# EAGLE board 16 seg display board (EAGLE 9.6.1), part 1 of 2
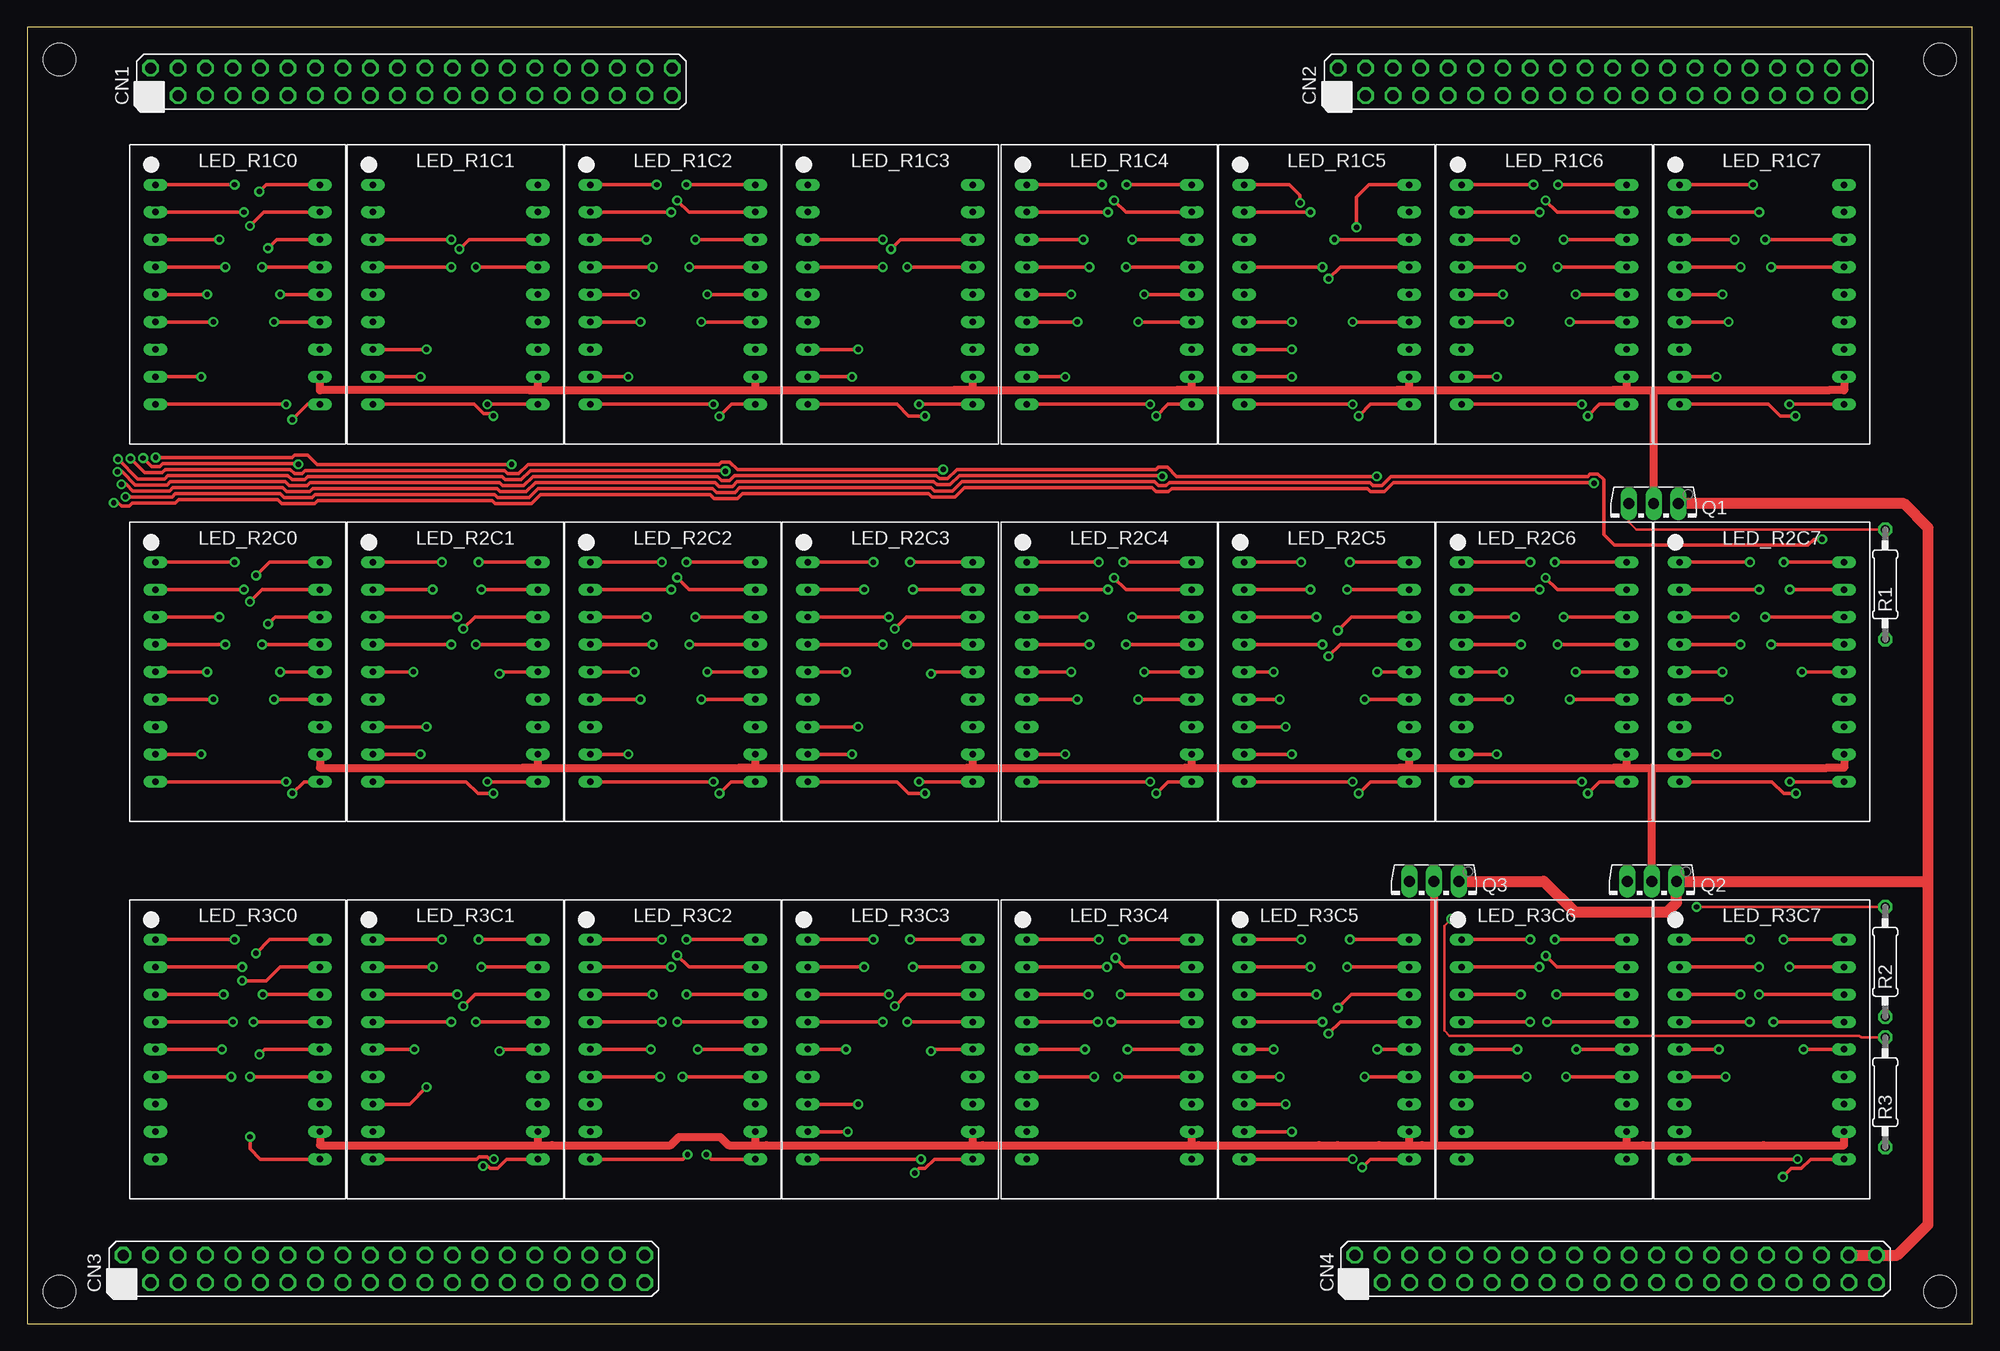
[diagram p2: board, top side]
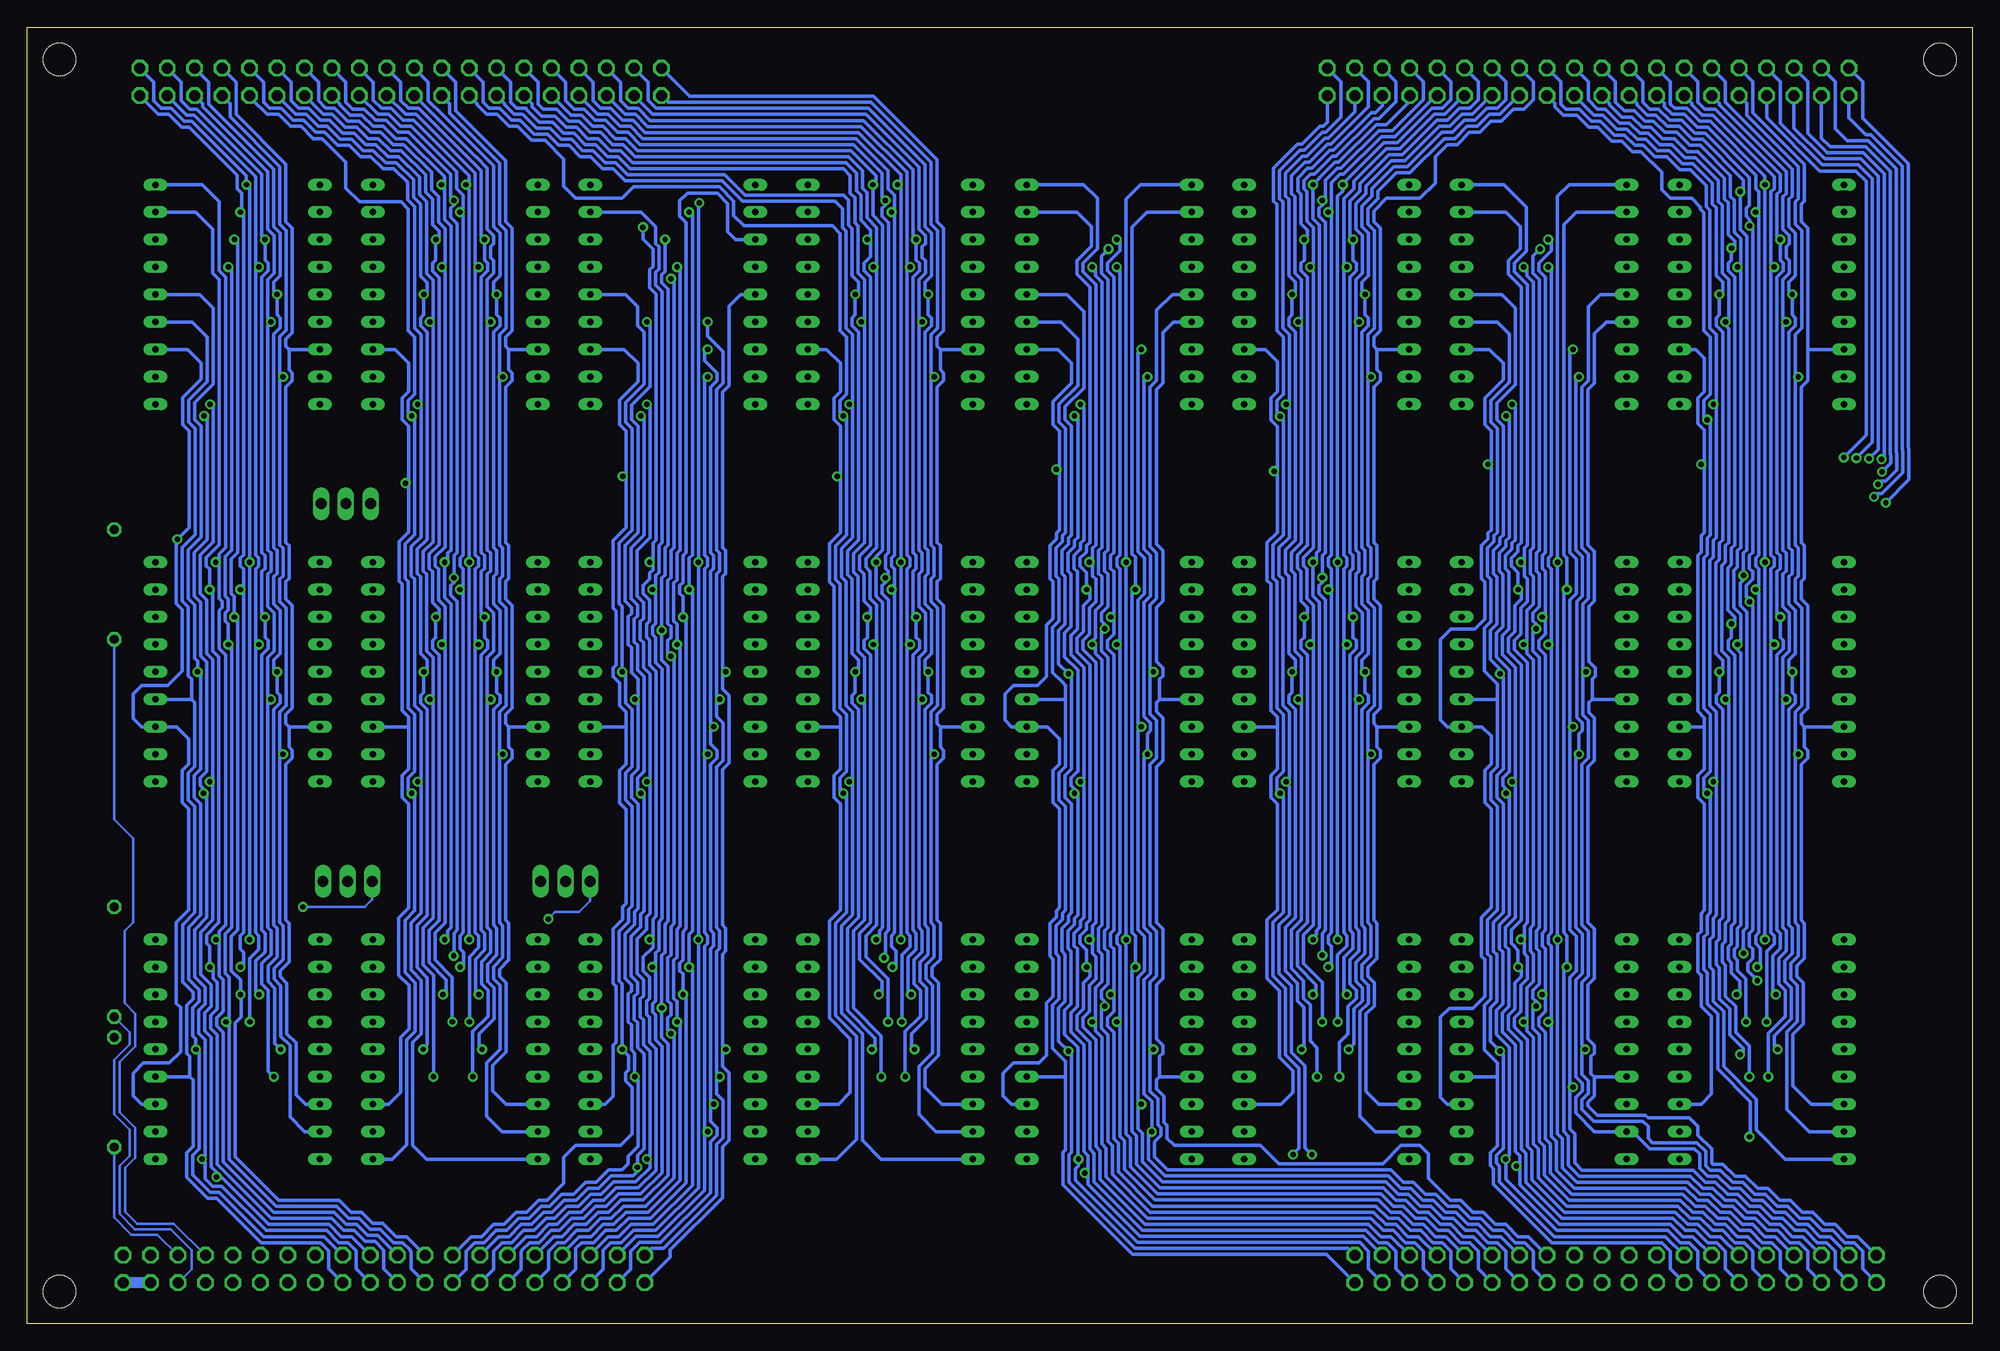
[diagram p3: board, bottom side, seen from below]

Size 180 x 120 mm. Coordinates in mm from the lower left corner, seen from the top.
Outline: 0,0 180,0 180,120 0,120 0,0
Copper layers (1*16): Top 0.035mm / dielectric 1.5mm / Bottom 0.035mm
Design rules "default *": minimum track width 10mil, minimum drill 0.35mm, track to track 10mil, track to pad 10mil, pad to pad 10mil, via to via 10mil, smd to smd 10mil, copper to edge 40mil, drill to drill 6mil, minimum pad ring 10mil, minimum via ring 8mil, stop-mask expansion 4mil, vias tented up to drill 20mil, thermal gap 10mil
Holes 3 mm at 3,117 177,117 177,3 3,3

## Footprints (pad centres in the part's own frame; a part is rotated, then mirrored left to right if it is on the bottom)
HDR40 = drill 1.016 octagon: 1 -24.13,-1.27; 2 -24.13,1.27; 3 -21.59,-1.27; 4 -21.59,1.27; 5 -19.05,-1.27; 6 -19.05,1.27; 7 -16.51,-1.27; 8 -16.51,1.27; 9 -13.97,-1.27; 10 -13.97,1.27; 11 -11.43,-1.27; 12 -11.43,1.27; 13 -8.89,-1.27; 14 -8.89,1.27; 15 -6.35,-1.27; 16 -6.35,1.27; 17 -3.81,-1.27; 18 -3.81,1.27; 19 -1.27,-1.27; 20 -1.27,1.27; 21 1.27,-1.27; 22 1.27,1.27; 23 3.81,-1.27; 24 3.81,1.27; 25 6.35,-1.27; 26 6.35,1.27; 27 8.89,-1.27; 28 8.89,1.27; 29 11.43,-1.27; 30 11.43,1.27; 31 13.97,-1.27; 32 13.97,1.27; 33 16.51,-1.27; 34 16.51,1.27; 35 19.05,-1.27; 36 19.05,1.27; 37 21.59,-1.27; 38 21.59,1.27; 39 24.13,-1.27; 40 24.13,1.27
PSA08-11SYKWA = drill 0.6 long: 1 -7.62,10.16; 2 -7.62,7.62; 3 -7.62,5.08; 4 -7.62,2.54; 5 -7.62,0; 6 -7.62,-2.54; 7 -7.62,-5.08; 8 -7.62,-7.62; 9 -7.62,-10.16; 10 7.62,-10.16; 11 7.62,-7.62; 12 7.62,-5.08; 13 7.62,-2.54; 14 7.62,0; 15 7.62,2.54; 16 7.62,5.08; 17 7.62,7.62; 18 7.62,10.16
TO126AV = drill 1.016 long: B 2.286,-1.27; C 0,-1.27; E -2.286,-1.27
0207/10 = drill 0.813 octagon: 1 -5.08,0; 2 5.08,0

## Placement (x,y rotation side)
CN1  [HDR40]  35.56,114.92 0 top
CN2  [HDR40]  145.44,114.92 0 top
CN3  [HDR40]  33.02,5.08 0 top
CN4  [HDR40]  146.98,5.08 0 top
LED_R1C0  PSA08-11SYKWA  [PSA08-11SYKWA]  19.5,95.25 0 top
LED_R1C1  PSA08-11SYKWA  [PSA08-11SYKWA]  39.62,95.25 0 top
LED_R1C2  PSA08-11SYKWA  [PSA08-11SYKWA]  59.75,95.25 0 top
LED_R1C3  PSA08-11SYKWA  [PSA08-11SYKWA]  79.88,95.25 0 top
LED_R1C4  PSA08-11SYKWA  [PSA08-11SYKWA]  100.12,95.25 0 top
LED_R1C5  PSA08-11SYKWA  [PSA08-11SYKWA]  120.25,95.25 0 top
LED_R1C6  PSA08-11SYKWA  [PSA08-11SYKWA]  140.38,95.25 0 top
LED_R1C7  PSA08-11SYKWA  [PSA08-11SYKWA]  160.5,95.25 0 top
LED_R2C0  PSA08-11SYKWA  [PSA08-11SYKWA]  19.5,60.33 0 top
LED_R2C1  PSA08-11SYKWA  [PSA08-11SYKWA]  39.62,60.33 0 top
LED_R2C2  PSA08-11SYKWA  [PSA08-11SYKWA]  59.75,60.33 0 top
LED_R2C3  PSA08-11SYKWA  [PSA08-11SYKWA]  79.88,60.33 0 top
LED_R2C4  PSA08-11SYKWA  [PSA08-11SYKWA]  100.12,60.33 0 top
LED_R2C5  PSA08-11SYKWA  [PSA08-11SYKWA]  120.25,60.33 0 top
LED_R2C6  PSA08-11SYKWA  [PSA08-11SYKWA]  140.38,60.33 0 top
LED_R2C7  PSA08-11SYKWA  [PSA08-11SYKWA]  160.5,60.33 0 top
LED_R3C0  PSA08-11SYKWA  [PSA08-11SYKWA]  19.5,25.4 0 top
LED_R3C1  PSA08-11SYKWA  [PSA08-11SYKWA]  39.62,25.4 0 top
LED_R3C2  PSA08-11SYKWA  [PSA08-11SYKWA]  59.75,25.4 0 top
LED_R3C3  PSA08-11SYKWA  [PSA08-11SYKWA]  79.88,25.4 0 top
LED_R3C4  PSA08-11SYKWA  [PSA08-11SYKWA]  100.12,25.4 0 top
LED_R3C5  PSA08-11SYKWA  [PSA08-11SYKWA]  120.25,25.4 0 top
LED_R3C6  PSA08-11SYKWA  [PSA08-11SYKWA]  140.38,25.4 0 top
LED_R3C7  PSA08-11SYKWA  [PSA08-11SYKWA]  160.5,25.4 0 top
Q1  BD438  [TO126AV]  150.5,74.61 180 top
Q2  BD438  [TO126AV]  150.34,39.69 180 top
Q3  BD438  [TO126AV]  130.18,39.69 180 top
R1  1K  [0207/10]  171.93,68.42 90 top
R2  1K  [0207/10]  171.93,33.5 90 top
R3  1K  [0207/10]  171.93,21.43 90 top

## Tracks (layer width: path | path; a pad name or v marks a point on that pad's centre or on a via)
+5V
  Top 1.016: CN4.38 CN4.40 173.04,6.35 175.9,9.21 175.9,40.96 | 175.9,40.96 175.9,73.66 173.67,75.88 Q1.E | 175.9,40.96 Q2.E 152.62,38.96 151.76,38.1 143.19,38.1 140.34,40.96 Q3.E
COL0_A  (via drill 0.5)
  Top 0.305: v19.21,105.41 LED_R1C0.1 | v19.21,70.48 LED_R2C0.1 | v19.21,35.56 LED_R3C0.1
  Bottom 0.305: CN1.16 27.94,114.92 27.94,112.87 27.55,112.48 26.43,112.48 25.23,111.28 24.27,111.28 19.21,106.22 v19.21,105.41 v19.21,70.48 v19.21,35.56
COL0_B  (via drill 0.5)
  Top 0.305: v21.49,104.78 22.12,105.41 LED_R1C0.18 | v21.2,69.25 22.43,70.48 LED_R2C0.18 | v21.19,34.29 22.46,35.56 LED_R3C0.18
  Bottom 0.305: CN1.17 31.04,112.94 31.04,112.8 30.08,111.84 29.28,111.84 28.25,110.81 27.13,110.81 25.92,109.6 24.96,109.6 21.19,105.82 21.19,105.08 v21.49,104.78 21.49,101.24 20.98,100.74 20.89,100.65 20.89,71.61 21.19,71.3 21.19,69.26 v21.2,69.25 21.2,68.82 21.49,68.53 21.49,66.48 20.89,65.88 20.89,36.68 21.19,36.38 v21.19,34.29
COL0_C  (via drill 0.5)
  Top 0.305: v22.3,99.54 23.1,100.33 LED_R1C0.16 | v22.3,64.77 22.94,65.41 LED_R2C0.16 | v21.82,30.48 LED_R3C0.16
  Bottom 0.305: CN1.19 33.58,112.94 33.58,112.8 32.46,111.68 31.5,111.68 30.54,110.72 29.74,110.72 28.71,109.69 27.59,109.69 26.39,108.48 25.43,108.48 22.94,106 22.94,104.07 22.6,103.73 22.6,100.78 22,100.18 22,99.84 v22.3,99.54 22.3,98.45 22.6,98.15 22.6,97.43 22,96.83 22,72.07 22.3,71.77 22.3,70.24 22.62,69.92 22.62,66.03 22,65.41 22,65.07 v22.3,64.77 22.3,63.52 22.6,63.22 22.6,62.45 22,61.85 22,37.14 22.3,36.84 22.3,35.18 22.6,34.88 22.6,33.7 22.3,33.4 22.3,32.47 21.51,31.68 21.51,30.78 v21.82,30.48
COL0_D  (via drill 0.5)
  Top 0.305: v22.86,92.71 LED_R1C0.13 | v22.86,57.78 LED_R2C0.13 | v20.64,22.86 LED_R3C0.13
  Bottom 0.305: CN1.22 35.56,114.92 35.56,113.27 34.69,112.39 33.97,112.39 32.69,111.12 31.73,111.12 30.77,110.16 29.97,110.16 28.94,109.13 27.82,109.13 26.62,107.92 25.66,107.92 23.5,105.77 23.5,103.84 23.16,103.5 23.16,97.2 22.56,96.6 22.56,93.01 v22.86,92.71 22.86,92.39 22.56,92.09 22.56,72.3 22.86,72 22.86,70.48 23.18,70.15 23.18,62.24 22.56,61.62 22.56,58.09 v22.86,57.78 22.56,57.48 22.56,37.37 22.86,37.07 22.86,35.41 23.16,35.11 23.16,33.47 22.86,33.17 22.86,30.31 21.91,29.36 21.91,26.99 20.64,25.72 v20.64,22.86
COL0_E  (via drill 0.5)
  Top 0.305: v20.64,17.3 20.64,16.19 21.59,15.24 LED_R3C0.10 | v24.54,83.66 25.97,85.09 LED_R1C0.10 | v24.54,49.08 25.62,50.16 LED_R2C0.10
  Bottom 0.305: CN1.23 38.66,112.94 38.66,112.64 37.85,111.84 36.6,111.84 35.48,110.72 34.66,110.72 33.38,109.44 32.42,109.44 31.46,108.48 30.66,108.48 28.73,106.55 28.73,104.93 27.94,104.14 25.97,104.14 25.18,103.35 25.18,103.14 24.84,102.8 24.84,91.89 24.24,91.29 24.24,86.05 24.84,85.45 24.84,83.96 v24.54,83.66 24.24,83.36 24.24,72.99 24.54,72.69 24.54,71.17 24.86,70.85 24.86,56.99 24.24,56.36 24.24,51.12 24.84,50.52 24.84,49.38 v24.54,49.08 24.24,48.78 24.24,38.07 24.54,37.77 24.54,36.1 24.84,35.8 24.84,32.78 24.54,32.48 24.54,29.62 23.58,28.66 23.58,23.59 20.56,20.57 20.56,17.38 v20.64,17.3
COL0_F  (via drill 0.5)
  Top 0.305: v23.98,85.09 LED_R1C0.9 | v23.98,50.16 LED_R2C0.9
  Bottom 0.305: CN1.24 38.1,114.92 38.1,112.87 37.62,112.39 36.37,112.39 35.25,111.28 34.43,111.28 33.15,110 32.19,110 31.23,109.04 30.43,109.04 29.4,108.01 28.28,108.01 27.08,106.81 26.12,106.81 24.62,105.31 24.62,103.37 24.28,103.03 24.28,92.12 23.68,91.52 23.68,85.39 v23.98,85.09 23.68,84.79 23.68,72.76 23.98,72.46 23.98,70.94 24.3,70.62 24.3,57.22 23.68,56.6 23.68,50.47 v23.98,50.16 23.68,49.86 23.68,37.84 23.98,37.54 23.98,35.87 24.28,35.57 24.28,33.01 23.98,32.71 23.98,29.85 23.02,28.89 23.02,23.82 20,20.8 20,17.94 17.3,15.24 LED_R3C0.9
COL0_G  (via drill 0.5)
  Top 0.305: v16.11,87.63 LED_R1C0.8 | v16.11,52.7 LED_R2C0.8
  Bottom 0.305: CN1.9 20.88,112.94 20.88,111.85 16.11,107.08 16.11,104.13 16.41,103.83 16.41,101.75 15.81,101.15 15.81,92.12 16.41,91.52 16.41,87.93 v16.11,87.63 16.41,87.33 16.41,86.68 16.41,72.07 16.11,71.77 16.11,69.2 16.41,68.9 16.41,66.83 15.81,66.22 15.81,57.63 15.81,57.2 16.41,56.6 16.41,53.01 v16.11,52.7 16.41,52.4 16.41,37.14 16.11,36.84 16.11,34.06 16.82,33.36 16.82,31.9 16.21,31.3 16.21,27.98 17.18,27.02 17.18,25.76 17.17,25.76 17.17,19.87 15.08,17.78 LED_R3C0.8
COL0_H  (via drill 0.5)
  Top 0.305: v18.35,97.79 LED_R1C0.4 | v18.35,62.87 LED_R2C0.4 | v19.05,27.94 LED_R3C0.4
  Bottom 0.305: CN1.13 25.96,112.94 25.96,112.8 25,111.84 24.04,111.84 18.35,106.15 18.35,105.05 18.65,104.75 18.65,98.09 v18.35,97.79 18.65,97.49 18.65,71.14 18.35,70.84 18.35,70.13 18.65,69.83 18.65,63.17 v18.35,62.87 18.65,62.56 18.65,36.22 18.35,35.92 18.35,35.15 19.05,34.45 v19.05,27.94
COL0_K  (via drill 0.5)
  Top 0.305: v17.79,100.33 LED_R1C0.3 | v17.79,65.41 LED_R2C0.3 | v18.19,30.48 LED_R3C0.3
  Bottom 0.305: CN1.14 25.4,114.92 25.4,113.03 24.77,112.39 23.81,112.39 17.79,106.38 17.79,104.82 18.09,104.52 18.09,100.63 v17.79,100.33 17.79,98.45 17.49,98.15 17.49,97.43 18.09,96.83 18.09,71.37 17.79,71.07 17.79,69.9 18.09,69.6 18.09,65.71 v17.79,65.41 17.79,63.52 17.49,63.22 17.49,62.51 18.09,61.91 18.09,36.45 17.79,36.15 17.79,34.76 18.49,34.05 18.49,30.78 v18.19,30.48
COL0_M  (via drill 0.5)
  Top 0.305: v20.07,102.87 LED_R1C0.2 | v20.07,67.94 LED_R2C0.2 | v19.91,33.02 LED_R3C0.2
  Bottom 0.305: CN1.15 28.5,112.94 28.5,112.64 27.78,111.92 26.66,111.92 25.46,110.72 24.5,110.72 20.07,106.29 20.07,105.05 19.77,104.75 19.77,103.17 v20.07,102.87 19.77,102.57 19.77,71.14 20.07,70.84 20.07,70.13 19.77,69.83 19.77,68.25 v20.07,67.94 19.77,67.64 19.77,36.22 20.07,35.92 20.07,35.2 19.61,34.74 19.61,33.32 v19.91,33.02
COL0_N  (via drill 0.5)
  Top 0.305: v20.63,101.6 21.9,102.87 LED_R1C0.17 | v20.63,66.83 21.74,67.94 LED_R2C0.17 | v19.91,31.75 22.13,31.75 23.4,33.02 LED_R3C0.17
  Bottom 0.305: CN1.18 30.48,114.92 30.48,113.03 29.84,112.39 29.04,112.39 28.01,111.36 26.89,111.36 25.69,110.16 24.73,110.16 20.63,106.06 20.63,103.53 20.93,103.23 20.93,102.49 20.58,102.15 20.58,101.6 v20.63,101.6 20.33,101.3 20.33,71.37 20.63,71.07 20.63,69.9 20.33,69.6 20.33,68.9 20.93,68.3 20.93,67.27 20.65,66.99 20.64,66.99 20.64,66.85 v20.63,66.83 20.33,66.53 20.33,36.45 20.63,36.15 20.63,34.97 20.33,34.67 20.33,33.82 20.77,33.38 20.77,32.66 20.27,32.16 20.25,32.16 19.84,31.75 v19.91,31.75
COL0_P  (via drill 0.5)
  Top 0.305: v21.75,97.79 LED_R1C0.15 | v21.75,62.87 LED_R2C0.15 | v20.95,27.94 LED_R3C0.15
  Bottom 0.305: CN1.20 33.02,114.92 33.02,113.03 32.23,112.24 31.27,112.24 30.31,111.28 29.51,111.28 28.48,110.25 27.36,110.25 26.15,109.04 25.19,109.04 22.38,106.23 22.38,104.3 22.05,103.96 22.05,101.01 21.44,100.41 21.44,98.09 v21.75,97.79 21.44,97.49 21.44,71.84 21.75,71.53 21.75,70.01 22.07,69.69 22.07,66.27 21.44,65.64 21.44,63.17 v21.75,62.87 21.75,62.38 21.44,62.08 21.44,36.91 21.75,36.61 21.75,34.95 22.05,34.65 22.05,33.93 21.75,33.63 21.75,32.7 20.95,31.91 v20.95,27.94
COL0_R  (via drill 0.5)
  Top 0.305: v23.42,95.25 LED_R1C0.14 | v23.42,60.33 LED_R2C0.14 | v21.5,24.92 21.97,25.4 LED_R3C0.14
  Bottom 0.305: CN1.21 35.02,111.84 34.2,111.84 32.92,110.56 31.96,110.56 31,109.6 30.2,109.6 29.17,108.57 28.05,108.57 26.85,107.37 25.89,107.37 24.06,105.54 24.06,103.6 23.72,103.27 23.72,96.97 23.12,96.37 23.12,95.55 v23.42,95.25 23.42,93.37 23.72,93.07 23.72,92.35 23.12,91.75 23.12,72.53 23.42,72.23 23.42,70.71 23.74,70.39 23.74,62.01 23.12,61.39 23.12,60.63 v23.42,60.33 23.42,58.44 23.72,58.14 23.72,57.43 23.12,56.83 23.12,37.61 23.42,37.3 23.42,35.64 23.72,35.34 23.72,33.24 23.42,32.94 23.42,30.08 22.47,29.13 22.47,26.76 21.2,25.49 21.2,25.23 v21.5,24.92
COL0_S  (via drill 0.5)
  Top 0.305: v17.23,92.71 LED_R1C0.6 | v17.23,57.78 LED_R2C0.6 | v18.89,22.86 LED_R3C0.6
  Bottom 0.305: CN1.11 23.42,112.94 23.42,112.8 17.23,106.61 17.23,104.59 17.53,104.29 17.53,101.29 16.93,100.69 16.93,99.97 17.23,99.67 17.23,98.68 16.93,98.38 16.93,97.2 17.53,96.6 17.53,93.01 v17.23,92.71 17.53,92.41 17.53,71.61 17.23,71.3 17.23,69.67 17.53,69.36 17.53,66.36 16.93,65.76 16.93,62.28 17.53,61.68 17.53,58.09 v17.23,57.78 17.53,57.48 17.53,36.68 17.23,36.38 17.23,34.52 17.93,33.82 17.93,31.44 17.33,30.84 17.33,28.44 18.89,26.88 v18.89,22.86
COL0_T
  Bottom 0.305: CN1.10 20.32,114.92 20.32,112.08 15.55,107.31 15.55,103.9 15.86,103.6 15.86,101.98 15.25,101.38 15.25,90.17 | 15.55,55.24 15.86,55.55 15.86,56.36 15.25,56.97 15.25,66.45 15.86,67.06 15.86,68.67 15.55,68.97 15.55,72 15.86,72.3 15.86,86.67 15.25,87.27 15.25,90.17 | 15.55,55.24 15.55,53.36 15.25,53.06 15.25,52.35 15.86,51.75 15.86,37.37 15.55,37.07 15.55,33.83 16.26,33.13 16.26,32.13 15.65,31.53 15.65,27.75 16.61,26.79 16.61,22.01 14.92,20.32 LED_R3C0.7 | LED_R1C0.7 15.25,90.17 | LED_R2C0.7 15.55,55.24
COL0_U  (via drill 0.5)
  Top 0.305: v16.67,95.25 LED_R1C0.5 | v16.67,60.33 LED_R2C0.5 | v18.03,25.4 LED_R3C0.5
  Bottom 0.305: CN1.12 22.86,114.92 22.86,113.03 16.67,106.84 16.67,104.36 16.97,104.06 16.97,101.52 16.37,100.92 16.37,96.97 16.97,96.37 16.97,95.55 v16.67,95.25 16.67,93.37 16.37,93.07 16.37,92.35 16.97,91.75 16.97,71.84 16.67,71.53 16.67,69.44 16.97,69.13 16.97,66.59 16.37,65.99 16.37,62.05 16.97,61.44 16.97,60.63 v16.67,60.33 16.67,58.44 16.37,58.14 16.37,57.43 16.97,56.83 16.97,36.91 16.67,36.61 16.67,34.29 17.37,33.59 17.37,31.67 16.77,31.07 16.77,28.21 18.33,26.65 18.33,25.7 v18.03,25.4
COL1_A  (via drill 0.5)
  Top 0.305: v38.39,35.56 LED_R3C1.1 | v38.39,70.48 LED_R2C1.1
  Bottom 0.305: CN3.5 15.24,5.08 15.24,6.73 16.03,7.52 16.89,7.52 18.01,8.64 18.96,8.64 20.08,9.75 21.04,9.75 22.16,10.87 23.12,10.87 24.24,11.99 25.2,11.99 26.31,13.11 36.59,13.11 37.93,14.45 37.93,17.12 38.39,17.58 38.39,35.43 v38.39,35.56 38.39,70.36 v38.39,70.48 38.39,104.33 37.31,105.41 LED_R1C1.1
COL1_B  (via drill 0.5)
  Top 0.305: v41.78,35.56 LED_R3C1.18 | v41.78,70.48 LED_R2C1.18
  Bottom 0.305: CN3.12 23.32,8.08 24.28,8.08 25.39,9.2 26.35,9.2 27.47,10.31 37.75,10.31 40.78,13.35 40.78,16.02 41.18,16.41 41.18,26.29 42.38,27.49 42.38,28.3 41.78,28.9 41.78,31.3 41.18,31.9 41.18,33.98 41.48,34.28 41.48,35.26 v41.78,35.56 41.48,35.86 41.48,36.84 41.18,37.14 41.18,61.21 42.38,62.42 42.38,63.22 41.78,63.82 41.78,66.22 41.18,66.83 41.18,68.9 41.48,69.2 41.48,70.18 v41.78,70.48 41.48,70.79 41.48,71.77 41.18,72.07 41.18,96.14 42.38,97.34 42.38,98.15 41.27,99.25 41.27,103.35 43.34,105.41 LED_R1C1.18
COL1_C  (via drill 0.5)
  Top 0.305: v40.36,29.4 41.45,30.48 LED_R3C1.16 | v40.36,64.32 41.45,65.41 LED_R2C1.16 | v40.01,99.45 40.89,100.33 LED_R1C1.16
  Bottom 0.305: CN3.10 20.78,8.08 21.74,8.08 22.85,9.2 23.81,9.2 24.93,10.31 25.89,10.31 27.01,11.43 37.28,11.43 39.6,13.75 39.6,14.13 39.6,16.42 40.06,16.88 40.06,26.75 40.66,27.35 40.66,29.1 v40.36,29.4 40.36,29.82 40.66,30.12 40.66,30.84 40.06,31.44 40.06,34.44 40.36,34.74 40.36,36.38 40.06,36.68 40.06,61.68 40.66,62.28 40.66,64.02 v40.36,64.32 40.36,64.75 40.66,65.05 40.66,65.76 40.06,66.36 40.06,69.36 40.36,69.67 40.36,71.3 40.06,71.61 40.06,96.6 40.66,97.2 40.66,98.8 v40.01,99.45
COL1_D
  Bottom 0.305: CN3.15 27.94,5.08 27.94,6.73 28.73,7.52 38.9,7.52 44.31,12.93 44.31,14.37 44.61,14.66 44.61,15.84 43.97,16.48 43.97,22.86 | LED_R1C1.13 43.97,92.71 42.86,91.6 42.86,87.16 44.58,85.44 44.58,83.42 43.97,82.82 43.97,73.22 44.27,72.92 44.27,72.39 44.88,71.79 44.88,69.18 44.58,68.88 44.58,64.98 45.18,64.38 45.18,60.41 43.97,59.2 43.97,57.78 | 43.97,57.78 43.97,51.59 44.58,50.98 44.58,48.49 43.97,47.89 43.97,38.3 44.88,37.4 44.88,34.25 44.58,33.95 44.58,30.05 45.18,29.45 45.18,25.35 44.12,24.29 43.97,24.15 43.97,22.86 | LED_R2C1.13 43.97,57.78 | LED_R3C1.13 43.97,22.86
COL1_E  (via drill 0.5)
  Top 0.305: LED_R3C1.10 44.4,15.24 43.55,14.39 42.84,14.39 42.62,14.61 v42.2,14.61 | v42.6,50.16 LED_R2C1.10 | v42.6,85.09 LED_R1C1.10
  Bottom 0.305: CN3.14 25.86,8.08 26.82,8.08 27.93,9.2 38.21,9.2 41.9,12.88 41.9,14.3 v42.2,14.61 41.9,14.91 41.9,15.55 42.3,15.95 42.3,25.82 43.5,27.03 43.5,28.76 42.9,29.36 42.9,34.65 43.2,34.95 43.2,36.7 42.3,37.61 42.3,49.86 v42.6,50.16 42.3,50.47 42.3,60.75 43.5,61.95 43.5,63.68 42.9,64.29 42.9,69.57 43.2,69.87 43.2,71.1 42.6,71.7 42.6,72.23 42.3,72.53 42.3,84.79 v42.6,85.09
COL1_F  (via drill 0.5)
  Top 0.305: LED_R3C1.9 41.62,15.24 41.84,15.46 42.56,15.46 42.77,15.25 v43.19,15.25 | v43.16,49.08 41.72,49.08 40.64,50.16 LED_R2C1.9 | v43.16,84.01 42.93,84.23 42.24,84.23 41.38,85.09 LED_R1C1.9
  Bottom 0.305: CN3.13 25.4,5.08 25.4,6.73 26.19,7.52 27.05,7.52 28.17,8.64 38.44,8.64 43.19,13.39 v43.19,15.25 42.86,15.59 42.86,25.59 44.06,26.8 44.06,28.99 43.46,29.59 43.46,34.42 43.76,34.72 43.76,36.94 42.86,37.84 42.86,48.78 v43.16,49.08 43.16,49.51 43.46,49.81 43.46,50.52 42.86,51.12 42.86,60.52 44.06,61.72 44.06,63.91 43.46,64.52 43.46,69.34 43.76,69.64 43.76,71.33 43.16,71.93 43.16,72.46 42.86,72.76 42.86,83.71 v43.16,84.01
COL1_G  (via drill 0.5)
  Top 0.305: v36.41,52.7 LED_R2C1.8 | v36.41,87.63 LED_R1C1.8
  Bottom 0.305: CN3.4 13.16,8.08 14.12,8.08 15.23,9.2 16.19,9.2 17.31,10.31 18.27,10.31 19.39,11.43 20.35,11.43 21.46,12.55 22.43,12.55 23.54,13.66 24.5,13.66 25.24,14.4 25.24,15.72 25.73,16.2 29.85,16.2 31.43,17.78 LED_R3C1.8 34.96,17.78 36.71,19.53 36.71,20.95 36.11,21.55 36.11,22.26 36.61,22.77 36.62,22.77 36.71,22.86 36.71,31.83 36.11,32.43 36.11,36.08 36.71,36.68 36.71,52.4 v36.41,52.7 36.41,54.59 36.11,54.89 36.11,55.6 36.61,56.1 36.61,66.85 36.11,67.36 36.11,71 36.71,71.61 36.71,87.33 v36.41,87.63
COL1_H  (via drill 0.5)
  Top 0.305: v39.24,27.94 LED_R3C1.4 | v39.24,62.87 LED_R2C1.4 | v39.24,97.79 LED_R1C1.4
  Bottom 0.305: CN3.8 18.24,8.08 19.2,8.08 20.31,9.2 21.27,9.2 22.39,10.31 23.35,10.31 24.47,11.43 25.43,11.43 26.55,12.55 36.82,12.55 38.49,14.21 38.49,16.89 38.95,17.34 38.95,27.64 v39.24,27.94 38.95,28.24 38.95,34.9 39.24,35.2 39.24,35.92 38.95,36.22 38.95,62.56 v39.24,62.87 38.95,63.17 38.95,69.83 39.24,70.13 39.24,70.84 38.95,71.14 38.95,97.49 v39.24,97.79
COL1_K  (via drill 0.5)
  Top 0.305: v39.8,30.48 LED_R3C1.3 | v39.8,65.41 LED_R2C1.3 | v39.24,100.33 LED_R1C1.3
  Bottom 0.305: CN3.7 17.78,5.08 17.78,6.73 18.57,7.52 19.43,7.52 20.55,8.64 21.5,8.64 22.62,9.75 23.58,9.75 24.7,10.87 25.66,10.87 26.78,11.99 37.05,11.99 39.05,13.98 39.05,16.66 39.5,17.11 39.5,26.98 40.1,27.58 40.1,28.3 39.5,28.9 39.5,30.18 v39.8,30.48 39.5,30.78 39.5,34.67 39.8,34.97 39.8,36.15 39.5,36.45 39.5,61.91 40.1,62.51 40.1,63.22 39.5,63.82 39.5,65.1 v39.8,65.41 39.5,65.71 39.5,69.6 39.8,69.9 39.8,71.07 39.5,71.37 39.5,96.83 40.1,97.43 40.1,98.15 38.95,99.31 38.95,100.03 v39.24,100.33
COL1_M  (via drill 0.5)
  Top 0.305: v37.53,33.02 LED_R3C1.2 | v37.53,67.94 LED_R2C1.2
  Bottom 0.305: CN3.6 15.7,8.08 16.66,8.08 17.77,9.2 18.73,9.2 19.85,10.31 20.81,10.31 21.93,11.43 22.89,11.43 24,12.55 24.96,12.55 26.08,13.66 36.36,13.66 37.37,14.68 37.37,17.35 37.83,17.81 37.83,32.72 v37.53,33.02 37.53,35.92 37.83,36.22 37.83,67.64 v37.53,67.94 37.53,70.84 37.83,71.14 37.83,101.71 36.67,102.87 LED_R1C1.2
COL1_N  (via drill 0.5)
  Top 0.305: v42.04,33.02 LED_R3C1.17 | v42.04,67.94 LED_R2C1.17
  Bottom 0.305: CN3.11 22.86,5.08 22.86,6.73 23.65,7.52 24.51,7.52 25.63,8.64 26.59,8.64 27.7,9.75 37.98,9.75 41.34,13.12 41.34,15.79 41.74,16.18 41.74,26.06 42.94,27.26 42.94,28.53 42.34,29.13 42.34,31.53 41.74,32.13 41.74,32.72 v42.04,33.02 42.04,34.58 42.39,34.92 42.39,34.95 42.64,35.2 42.64,36.47 41.74,37.37 41.74,60.98 42.94,62.19 42.94,63.45 42.34,64.05 42.34,66.45 41.74,67.06 41.74,67.64 v42.04,67.94 42.04,69.5 42.39,69.85 42.39,69.87 42.64,70.13 42.64,70.84 42.39,71.1 42.39,71.12 42.04,71.47 42.04,72 41.74,72.3 41.74,95.91 42.94,97.11 42.94,98.38 41.83,99.48 41.83,101.52 43.18,102.87 LED_R1C1.17
COL1_P  (via drill 0.5)
  Top 0.305: v41.52,27.94 LED_R3C1.15 | v41.52,62.87 LED_R2C1.15 | v41.52,97.79 LED_R1C1.15
  Bottom 0.305: CN3.9 20.32,5.08 20.32,6.73 21.11,7.52 21.97,7.52 23.09,8.64 24.05,8.64 25.16,9.75 26.12,9.75 27.24,10.87 37.52,10.87 40.16,13.52 40.16,14.13 40.16,16.19 40.62,16.65 40.62,26.52 41.22,27.12 41.22,27.64 v41.52,27.94 41.22,28.24 41.22,31.07 40.62,31.67 40.62,34.21 40.92,34.51 40.92,36.61 40.62,36.91 40.62,61.44 41.22,62.05 41.22,62.56 v41.52,62.87 41.22,63.17 41.22,65.99 40.62,66.59 40.62,69.13 40.92,69.44 40.92,71.53 40.62,71.84 40.62,96.37 41.22,96.97 41.22,97.49 v41.52,97.79
COL1_R  (via drill 0.5)
  Top 0.305: v43.72,25.24 43.88,25.4 LED_R3C1.14 | v43.72,60.16 43.88,60.33 LED_R2C1.14
  Bottom 0.305: CN3.16 28.4,8.08 38.67,8.08 43.75,13.16 43.75,14.6 44.05,14.9 44.05,15.61 43.41,16.25 43.41,24.94 v43.72,25.24 44.62,26.14 44.62,29.22 44.02,29.82 44.02,34.18 44.32,34.48 44.32,37.17 43.41,38.07 43.41,48.12 44.02,48.73 44.02,50.75 43.41,51.35 43.41,59.86 v43.72,60.16 43.72,60.59 44.62,61.49 44.62,64.15 44.02,64.75 44.02,69.11 44.32,69.41 44.32,71.56 43.72,72.16 43.72,72.69 43.41,72.99 43.41,83.05 44.02,83.65 44.02,85.21 42.3,86.92 42.3,94 43.55,95.25 LED_R1C1.14
COL1_S
  Bottom 0.305: CN3.2 10.62,8.08 11.58,8.08 12.69,9.2 13.65,9.2 14.78,10.32 15.74,10.32 16.85,11.43 17.81,11.43 18.93,12.55 19.89,12.55 21,13.66 21.96,13.66 23.08,14.78 24.04,14.78 24.12,14.87 24.12,16.18 25.4,17.46 25.4,18.26 26.19,19.05 30.01,19.05 30.26,19.3 34.73,19.3 35.59,20.16 35.59,20.49 34.99,21.09 34.99,22.83 | 34.99,22.83 34.99,22.86 LED_R3C1.6 | 35.19,57.78 35.19,59.67 34.89,59.97 34.89,60.68 35.49,61.28 35.49,66.39 34.99,66.89 34.99,71.47 35.59,72.07 35.59,86.44 34.99,87.04 34.99,91.62 33.9,92.71 LED_R1C1.6 | 34.99,22.83 35.29,23.14 35.29,24.74 34.99,25.04 34.99,25.76 35.59,26.36 35.59,31.37 34.99,31.97 34.99,36.54 35.59,37.14 35.59,51.52 34.99,52.12 34.99,56.06 35.49,56.57 35.49,57.48 35.19,57.78 | LED_R2C1.6 35.19,57.78
COL1_T  (via drill 0.5)
  Top 0.305: v36.97,21.91 35.38,20.32 LED_R3C1.7 | v36.97,55.24 LED_R2C1.7 | v36.97,90.17 LED_R1C1.7
  Bottom 0.305: CN3.3 12.7,5.08 12.7,6.73 13.49,7.52 14.35,7.52 15.47,8.64 16.43,8.64 17.54,9.75 18.5,9.75 19.62,10.87 20.58,10.87 21.7,11.99 22.66,11.99 23.77,13.11 24.73,13.11 25.85,14.22 36.13,14.22 36.81,14.91 36.81,17.58 37.27,18.04 37.27,21.61 v36.97,21.91 37.27,22.21 37.27,32.06 36.67,32.66 36.67,35.85 37.27,36.45 37.27,54.94 v36.97,55.24 37.27,55.55 37.27,66.99 36.67,67.59 36.67,70.77 37.27,71.37 37.27,89.87 v36.97,90.17
COL1_U  (via drill 0.5)
  Top 0.305: v35.85,25.4 LED_R3C1.5 | v35.75,60.33 LED_R2C1.5
  Bottom 0.305: CN3.1 10.16,5.08 10.16,6.73 10.95,7.52 11.81,7.52 12.93,8.64 13.88,8.64 15,9.75 15.96,9.75 17.08,10.87 18.04,10.87 19.16,11.99 20.12,11.99 21.23,13.11 22.19,13.11 23.31,14.22 24.27,14.22 24.68,14.64 24.68,15.95 25.49,16.76 29.62,16.76 30,17.14 30,18.26 30.49,18.74 35.05,18.74 36.15,19.84 36.15,20.72 35.55,21.32 35.55,22.5 36.15,23.1 36.15,25.1 v35.85,25.4 35.85,25.53 36.15,25.83 36.15,31.6 35.55,32.2 35.55,36.31 36.15,36.91 36.15,51.75 35.55,52.35 35.55,55.83 36.05,56.34 36.05,60.02 v35.75,60.33 36.05,60.63 36.05,66.62 35.55,67.13 35.55,71.23 36.15,71.84 36.15,86.67 35.55,87.27 35.55,94.13 34.43,95.25 LED_R1C1.5
COL2_A  (via drill 0.5)
  Top 0.305: v58.74,70.48 LED_R2C2.1 | v58.74,35.56 LED_R3C2.1 | v58.26,105.41 LED_R1C2.1
  Bottom 0.305: CN1.32 48.26,114.92 48.26,113.27 49.05,112.48 50.01,112.48 53.19,109.29 54.48,109.29 58.26,105.51 v58.26,105.41 58.26,104.83 58.74,104.35 v58.74,70.48 v58.74,35.56
COL2_B  (via drill 0.5)
  Top 0.305: v61.02,105.41 LED_R1C2.18 | v61.02,70.48 LED_R2C2.18 | v61.02,35.56 LED_R3C2.18
  Bottom 0.305: CN1.33 52.07,113.11 54.21,110.97 55.17,110.97 58.66,107.48 58.99,107.48 60.41,106.05 60.41,106.01 v61.02,105.41 61.02,102.28 60.41,101.68 60.41,71.61 60.72,71.3 60.72,70.79 v61.02,70.48 61.02,67.36 60.41,66.76 60.41,36.68 60.72,36.38 60.72,36.02 61.02,35.72 v61.02,35.56
COL2_C  (via drill 0.5)
  Top 0.305: v61.83,100.33 LED_R1C2.16 | v61.83,65.41 LED_R2C2.16 | v61.03,30.48 LED_R3C2.16
  Bottom 0.305: v61.03,30.48 60.73,30.78 60.73,31.36 62.47,33.11 62.47,36.2 61.53,37.14 61.53,61.91 62.13,62.51 62.13,63.22 61.83,63.52 v61.83,65.41 61.53,65.71 61.53,66.29 62.13,66.89 62.13,69.6 62.47,69.94 62.47,71.13 61.53,72.07 61.53,96.84 61.62,96.93 61.63,96.93 62.13,97.43 62.13,98.15 61.83,98.45 v61.83,100.33 61.53,100.63 61.53,101.22 62.13,101.82 62.13,104.52 62.43,104.82 62.43,105.73 62.43,106 61.51,106.92 61.13,106.92 59.45,108.6 59.12,108.6 55.63,112.09 55.23,112.09 54.61,112.71 CN1.35
COL2_D  (via drill 0.5)
  Top 0.305: v62.39,92.71 LED_R1C2.13 | v62.39,57.78 LED_R2C2.13 | v60.64,22.86 LED_R3C2.13
  Bottom 0.305: CN1.38 55.88,114.92 55.88,112.63 59.36,109.16 59.68,109.16 61.36,107.48 61.74,107.48 62.99,106.23 | 62.99,106.23 62.99,106.05 | 62.99,106.05 62.99,104.59 62.69,104.29 62.69,97.2 62.09,96.6 62.09,93.01 v62.39,92.71 62.09,92.41 62.09,72.3 63.03,71.36 63.03,69.7 62.69,69.36 62.69,62.28 62.09,61.68 62.09,58.09 v62.39,57.78 62.09,57.48 62.09,37.37 63.03,36.43 63.03,32.88 61.88,31.73 61.88,30.12 61.28,29.52 61.28,26.19 60.64,25.56 v60.64,22.86 | 62.99,106.05 62.99,106.23
COL2_E  (via drill 0.5)
  Top 0.305: v62.87,15.67 63.29,15.24 LED_R3C2.10 | v64.07,83.98 65.18,85.09 LED_R1C2.10 | v64.07,49.08 65.15,50.16 LED_R2C2.10
  Bottom 0.305: v62.87,15.67 62.31,16.22 62.31,23.64 63.56,24.89 63.56,31.04 64.71,32.18 64.71,37.13 63.77,38.07 63.77,48.78 v64.07,49.08 64.37,49.38 64.37,50.52 63.77,51.12 63.77,56.36 64.37,56.97 64.37,68.67 64.71,69.01 64.71,72.05 63.77,72.99 63.77,83.68 v64.07,83.98 64.37,84.28 64.37,85.45 63.77,86.05 63.77,91.29 64.37,91.89 64.37,103.6 64.67,103.9 64.67,106.92 62.44,109.16 62.05,109.16 60.38,110.83 60.05,110.83 59.69,111.19 CN1.39
COL2_F  (via drill 0.5)
  Top 0.305: v63.51,85.09 LED_R1C2.9 | v63.51,50.16 LED_R2C2.9 | v61.12,15.67 60.69,15.24 LED_R3C2.9
  Bottom 0.305: CN1.40 58.42,114.92 58.42,111.67 59.82,110.27 60.15,110.27 61.82,108.6 62.2,108.6 64.11,106.69 64.11,104.13 63.81,103.83 63.81,92.12 63.21,91.52 63.21,85.39 v63.51,85.09 63.21,84.79 63.21,72.76 64.15,71.82 64.15,69.24 63.81,68.9 63.81,57.2 63.21,56.6 63.21,50.47 v63.51,50.16 63.51,50.02 63.21,49.71 63.21,37.84 64.15,36.9 64.15,32.41 63,31.27 63,25.12 61.75,23.87 61.75,16.3 v61.12,15.67
COL2_G  (via drill 0.5)
  Top 0.305: v55.64,87.63 LED_R1C2.8 | v55.64,52.7 LED_R2C2.8
  Bottom 0.305: CN1.25 42.01,113.65 43.73,111.92 44.69,111.92 45.81,110.81 46.77,110.81 47.89,109.69 48.85,109.69 52.04,106.5 53.32,106.5 55.01,104.81 55.01,104.13 55.94,103.19 55.94,101.75 55.34,101.15 55.34,93.3 55.34,92.12 55.94,91.52 55.94,87.93 v55.64,87.63 55.94,87.33 55.94,72.07 55.64,71.77 55.64,69.2 55.94,68.9 55.94,66.83 55.34,66.22 55.34,57.2 55.94,56.6 55.94,53.01 v55.64,52.7 55.94,52.4 55.94,37.14 55.64,36.84 55.64,34.06 56.5,33.2 56.5,31.9 55.9,31.3 55.9,29.66 56.67,28.89 56.67,19.2 55.24,17.78 LED_R3C2.8
COL2_H  (via drill 0.5)
  Top 0.305: v57.88,97.79 LED_R1C2.4 | v57.88,62.87 LED_R2C2.4 | v58.74,27.94 LED_R3C2.4
  Bottom 0.305: CN1.29 47.09,113.65 48.81,111.92 49.77,111.92 52.96,108.73 54.25,108.73 57.24,105.74 57.24,105.05 58.18,104.12 58.18,98.09 v57.88,97.79 58.18,97.49 58.18,71.14 57.88,70.84 57.88,70.13 58.18,69.83 58.18,63.17 v57.88,62.87 58.18,62.56 58.18,36.22 57.88,35.92 57.88,34.99 58.74,34.13 v58.74,27.94
COL2_K  (via drill 0.5)
  Top 0.305: v57.32,100.33 LED_R1C2.3 | v57.32,65.41 LED_R2C2.3 | v57.88,30.48 LED_R3C2.3
  Bottom 0.305: CN1.30 45.72,114.92 45.72,113.27 46.51,112.48 47.47,112.48 48.58,111.36 49.54,111.36 52.73,108.18 54.01,108.18 56.68,105.51 56.68,104.82 57.62,103.89 57.62,100.63 v57.32,100.33 57.32,98.45 57.02,98.15 57.02,97.43 57.62,96.83 57.62,71.37 57.32,71.07 57.32,69.9 57.62,69.6 57.62,65.71 v57.32,65.41 57.32,63.52 57.02,63.22 57.02,62.51 57.62,61.91 57.62,36.45 57.32,36.15 57.32,34.76 58.18,33.9 58.18,30.78 v57.88,30.48
COL2_M  (via drill 0.5)
  Top 0.305: v59.6,102.87 LED_R1C2.2 | v59.6,67.94 LED_R2C2.2 | v59.6,33.02 LED_R3C2.2
  Bottom 0.305: CN1.31 49.63,113.65 53.42,109.85 54.71,109.85 58.2,106.36 58.52,106.36 59.3,105.59 59.3,103.17 v59.6,102.87 59.3,102.57 59.3,71.14 59.6,70.84 59.6,70.13 59.3,69.83 59.3,68.25 v59.6,67.94 59.3,67.64 59.3,36.22 59.6,35.92 59.6,35.2 59.3,34.9 59.3,33.32 v59.6,33.02
COL2_N  (via drill 0.5)
  Top 0.305: v60.16,103.95 61.24,102.87 LED_R1C2.17 | v60.16,69.06 61.27,67.94 LED_R2C2.17 | v60.16,34.1 61.24,33.02 LED_R3C2.17
  Bottom 0.305: CN1.34 50.8,114.92 50.8,113.27 53.66,110.41 54.94,110.41 58.43,106.92 58.76,106.92 59.85,105.82 59.85,104.25 v60.16,103.95 60.16,103.53 60.46,103.23 60.46,102.51 59.95,102.01 59.94,102.01 59.85,101.92 59.85,71.37 60.16,71.07 v60.16,69.06 60.16,68.6 60.46,68.3 60.46,67.59 59.95,67.08 59.94,67.08 59.85,67 59.85,36.45 60.16,36.15 v60.16,34.1
COL2_P  (via drill 0.5)
  Top 0.305: v61.27,97.79 LED_R1C2.15 | v61.27,62.87 LED_R2C2.15 | v60.17,27.94 LED_R3C2.15
  Bottom 0.305: CN1.36 53.34,114.92 53.34,113.11 54.92,111.53 55.4,111.53 58.89,108.04 59.22,108.04 60.9,106.36 61.28,106.36 61.88,105.77 61.88,105.05 61.57,104.75 61.57,102.05 60.97,101.45 60.97,98.09 v61.27,97.79 61.27,97.63 60.97,97.33 60.97,71.84 61.91,70.9 61.91,70.17 61.57,69.83 61.57,67.13 60.97,66.52 60.97,63.17 v61.27,62.87 v61.27,62.86 60.97,62.56 60.97,36.91 61.91,35.97 61.91,33.34 60.17,31.59 v60.17,27.94
COL2_R  (via drill 0.5)
  Top 0.305: v62.95,95.25 LED_R1C2.14 | v62.95,60.33 LED_R2C2.14 | v62.07,25.4 LED_R3C2.14
  Bottom 0.305: v62.07,25.4 61.84,25.64 61.84,29.29 62.44,29.89 62.44,31.5 63.59,32.64 63.59,36.67 62.65,37.61 62.65,56.83 63.25,57.43 63.25,58.14 62.95,58.44 v62.95,60.33 62.65,60.63 62.65,61.44 63.25,62.05 63.25,69.13 63.59,69.47 63.59,71.59 62.65,72.53 62.65,91.75 63.25,92.35 63.25,93.07 62.95,93.37 v62.95,95.25 62.65,95.55 62.65,96.37 63.25,96.97 63.25,104.06 63.55,104.36 63.55,106.46 61.97,108.04 61.59,108.04 59.91,109.72 59.59,109.72 57.15,112.15 CN1.37
COL2_S  (via drill 0.5)
  Top 0.305: v56.76,92.71 LED_R1C2.6 | v56.76,57.78 LED_R2C2.6 | v58.58,22.86 LED_R3C2.6
  Bottom 0.305: CN1.27 44.55,113.65 46.27,111.92 47.23,111.92 48.35,110.81 49.31,110.81 52.5,107.62 53.78,107.62 56.12,105.28 56.12,104.59 57.06,103.66 57.06,101.29 56.46,100.69 56.46,97.2 57.06,96.6 57.06,93.01 v56.76,92.71 57.06,92.41 57.06,71.61 56.76,71.3 56.76,69.67 57.06,69.36 57.06,66.36 56.46,65.76 56.46,62.28 57.06,61.68 57.06,58.09 v56.76,57.78 57.06,57.48 57.06,36.68 56.76,36.38 56.76,34.53 57.62,33.67 57.62,31.44 57.02,30.84 57.02,30.12 57.78,29.36 57.78,26.83 58.58,26.04 v58.58,22.86
COL2_T
  Bottom 0.305: CN1.26 40.64,114.92 40.64,113.27 41.51,112.39 42.47,112.39 43.58,111.28 44.54,111.28 45.58,110.25 46.54,110.25 47.66,109.13 48.58,109.13 49.69,108.02 49.69,105.57 51.12,104.14 54.2,104.14 55.38,102.96 55.38,101.98 54.78,101.38 54.78,91.89 55.38,91.29 55.38,90.47 55.08,90.17 | 55.08,90.17 55.08,88.29 54.78,87.99 54.78,87.27 55.38,86.67 55.38,72.3 55.08,72 55.08,68.97 55.38,68.67 55.38,67.06 54.78,66.45 54.78,56.97 55.38,56.36 55.38,55.55 55.08,55.24 | 55.08,55.24 55.08,53.36 54.78,53.06 54.78,52.35 55.38,51.75 55.38,37.37 55.08,37.07 55.08,33.83 55.94,32.97 55.94,32.13 55.34,31.53 55.34,29.43 56.11,28.66 56.11,21.5 54.93,20.32 LED_R3C2.7 | LED_R1C2.7 55.08,90.17 | LED_R2C2.7 55.08,55.24
COL2_U  (via drill 0.5)
  Top 0.305: v56.2,95.25 LED_R1C2.5 | v56.2,60.33 LED_R2C2.5 | v57.72,25.4 LED_R3C2.5
  Bottom 0.305: CN1.28 43.18,114.92 43.18,113.27 43.97,112.48 44.92,112.48 46.04,111.36 47,111.36 48.12,110.25 49.08,110.25 52.27,107.06 53.55,107.06 55.57,105.04 55.57,104.36 56.5,103.42 56.5,101.52 55.9,100.92 55.9,96.97 56.5,96.37 56.5,95.55 v56.2,95.25 56.2,93.37 55.9,93.07 55.9,92.35 56.5,91.75 56.5,71.84 56.2,71.53 56.2,69.44 56.5,69.13 56.5,66.59 55.9,65.99 55.9,62.05 56.5,61.44 56.5,60.63 v56.2,60.33 56.2,58.44 55.9,58.14 55.9,57.43 56.5,56.83 56.5,36.91 56.2,36.61 56.2,34.3 57.06,33.44 57.06,31.67 56.46,31.07 56.46,29.89 57.23,29.13 57.23,25.89 v57.72,25.4
COL3_A  (via drill 0.5)
  Top 0.305: v78.31,35.56 LED_R3C3.1 | v78.31,70.48 LED_R2C3.1
  Bottom 0.305: CN3.29 45.72,5.08 45.72,6.73 46.51,7.52 47.37,7.52 48.49,8.64 49.45,8.64 50.56,9.75 51.52,9.75 52.64,10.87 53.6,10.87 54.74,12.01 75.39,12.01 77.92,14.54 77.92,17.17 78.31,17.57 78.31,35.51 v78.31,35.56 78.31,70.43 v78.31,70.48 78.31,104.09 76.99,105.41 LED_R1C3.1
COL3_B  (via drill 0.5)
  Top 0.305: v81.71,35.56 LED_R3C3.18 | v81.71,70.48 LED_R2C3.18
  Bottom 0.305: CN3.36 53.8,8.08 54.76,8.08 55.9,9.22 76.54,9.22 80.71,13.39 80.71,16.02 81.11,16.41 81.11,26.29 82.31,27.49 82.31,28.3 81.71,28.9 81.71,31.31 81.11,31.91 81.11,33.98 81.41,34.28 81.41,35.26 v81.71,35.56 81.41,35.86 81.41,36.84 81.11,37.14 81.11,61.21 82.31,62.42 82.31,63.22 81.71,63.82 81.71,66.22 81.11,66.83 81.11,68.9 81.41,69.2 81.41,70.18 v81.71,70.48 81.41,70.79 81.41,71.77 81.11,72.07 81.11,96.14 82.31,97.34 82.31,98.15 80.96,99.5 80.96,104.14 82.23,105.41 LED_R1C3.18
COL3_C  (via drill 0.5)
  Top 0.305: v80.29,29.4 81.37,30.48 LED_R3C3.16 | v80.29,64.32 81.37,65.41 LED_R2C3.16 | v79.94,99.45 80.81,100.33 LED_R1C3.16
  Bottom 0.305: CN3.34 51.26,8.08 52.22,8.08 53.33,9.2 54.29,9.2 55.44,10.34 76.08,10.34 79.59,13.85 79.59,16.48 79.99,16.88 79.99,26.75 80.59,27.35 80.59,29.1 v80.29,29.4 80.29,29.82 80.59,30.12 80.59,30.85 79.99,31.45 79.99,34.44 80.29,34.74 80.29,36.38 79.99,36.68 79.99,61.68 80.59,62.28 80.59,64.02 v80.29,64.32 80.29,64.75 80.59,65.05 80.59,65.76 79.99,66.36 79.99,69.36 80.29,69.67 80.29,71.3 79.99,71.61 79.99,96.6 80.59,97.2 80.59,98.8 v79.94,99.45
COL3_D
  Bottom 0.305: CN3.39 59.77,6.43 77.7,6.43 84.14,12.86 84.14,15.87 83.9,16.11 83.9,22.86 | 83.9,22.86 83.9,24.28 85.11,25.48 85.11,29.45 84.5,30.05 84.5,33.98 84.81,34.28 84.81,36.84 84.2,37.44 84.2,38 83.9,38.3 83.9,47.89 84.5,48.49 84.5,50.98 83.9,51.59 83.9,57.63 83.9,57.78 | 83.9,57.78 83.9,59.07 84.2,59.37 85.11,60.27 85.11,64.44 84.5,65.04 84.5,68.9 84.81,69.2 84.81,71.77 84.2,72.37 84.2,72.92 83.9,73.22 83.9,82.82 84.5,83.42 84.5,85.12 82.78,86.84 82.78,91.14 84.36,92.71 LED_R1C3.13 | LED_R2C3.13 83.9,57.78 | LED_R3C3.13 83.9,22.86
COL3_E  (via drill 0.5)
  Top 0.305: v82.13,13.97 82.53,14.37 83.08,14.37 83.94,15.24 LED_R3C3.10 | v82.53,50.16 LED_R2C3.10 | v82.53,85.09 LED_R1C3.10
  Bottom 0.305: CN3.38 56.36,8.1 77.01,8.1 81.83,12.92 81.83,13.81 81.99,13.97 v82.13,13.97 81.83,14.27 81.83,15.55 82.23,15.95 82.23,25.82 83.43,27.03 83.43,28.76 82.83,29.36 82.83,34.67 83.13,34.97 83.13,36.15 82.53,36.75 82.53,37.3 82.23,37.61 82.23,49.86 v82.53,50.16 82.23,50.47 82.23,60.75 83.43,61.95 83.43,63.68 82.83,64.29 82.83,69.6 83.13,69.9 83.13,71.07 82.53,71.67 82.53,72.23 82.23,72.53 82.23,84.79 v82.53,85.09
COL3_F  (via drill 0.5)
  Top 0.305: v82.72,15.23 72.27,15.23 LED_R3C3.9 | v83.09,49.08 81.57,49.08 80.49,50.16 LED_R2C3.9 | v83.09,84.01 81.57,84.01 80.49,85.09 LED_R1C3.9
  Bottom 0.305: CN3.37 55.88,5.08 55.88,6.73 56.69,7.54 77.24,7.54 82.99,13.29 82.99,14.33 82.71,14.61 v82.71,15.22 v82.72,15.23 82.72,15.65 82.78,15.72 82.78,25.59 83.99,26.8 83.99,28.99 83.39,29.59 83.39,34.44 83.69,34.74 83.69,36.38 83.09,36.98 83.09,37.54 82.78,37.84 82.78,48.78 v83.09,49.08 83.09,49.51 83.39,49.81 83.39,50.52 82.88,51.02 82.78,51.12 82.78,60.52 83.99,61.72 83.99,63.91 83.39,64.52 83.39,69.36 83.69,69.67 83.69,71.3 83.09,71.91 83.09,72.46 82.78,72.76 82.78,83.71 v83.09,84.01
COL3_G  (via drill 0.5)
  Top 0.305: v75.94,17.78 LED_R3C3.8 | v76.34,52.7 LED_R2C3.8 | v76.34,87.63 LED_R1C3.8
  Bottom 0.305: CN3.28 43.64,8.08 44.6,8.08 45.71,9.2 46.67,9.2 47.79,10.31 48.75,10.31 49.87,11.43 50.83,11.43 51.95,12.55 52.91,12.55 54.05,13.69 74.69,13.69 76.24,15.24 76.24,17.48 v75.94,17.78 75.94,20.58 76.64,21.28 76.64,31.83 76.04,32.43 76.04,36.08 76.64,36.68 76.64,52.4 v76.34,52.7 76.34,54.59 76.04,54.89 76.04,55.6 76.64,56.2 76.64,66.76 76.04,67.36 76.04,71.11 76.64,71.71 76.64,87.33 v76.34,87.63
COL3_H  (via drill 0.5)
  Top 0.305: v79.17,27.94 LED_R3C3.4 | v79.17,62.87 LED_R2C3.4 | v79.17,97.79 LED_R1C3.4
  Bottom 0.305: CN3.32 48.72,8.08 49.68,8.08 50.79,9.2 51.75,9.2 52.87,10.31 53.83,10.31 54.97,11.46 75.62,11.46 78.47,14.31 78.47,16.94 78.87,17.34 78.87,27.64 v79.17,27.94 78.87,28.24 78.87,34.9 79.17,35.2 79.17,35.92 78.87,36.22 78.87,62.56 v79.17,62.87 78.87,63.17 78.87,69.83 79.17,70.13 79.17,70.84 78.87,71.14 78.87,97.49 v79.17,97.79
COL3_K  (via drill 0.5)
  Top 0.305: v79.73,30.48 LED_R3C3.3 | v79.73,65.41 LED_R2C3.3 | v79.17,100.33 LED_R1C3.3
  Bottom 0.305: CN3.31 48.26,5.08 48.26,6.73 49.05,7.52 49.91,7.52 51.03,8.64 51.98,8.64 53.1,9.75 54.06,9.75 55.2,10.9 75.85,10.9 79.03,14.08 79.03,16.71 79.43,17.11 79.43,26.98 80.03,27.58 80.03,28.3 79.43,28.9 79.43,30.18 v79.73,30.48 79.43,30.78 79.43,34.67 79.73,34.97 79.73,36.15 79.43,36.45 79.43,61.91 80.03,62.51 80.03,63.22 79.43,63.82 79.43,65.1 v79.73,65.41 79.43,65.71 79.43,69.6 79.73,69.9 79.73,71.07 79.43,71.37 79.43,96.83 80.03,97.43 80.03,98.15 78.87,99.31 78.87,100.03 v79.17,100.33
COL3_M  (via drill 0.5)
  Top 0.305: v77.45,33.02 LED_R3C3.2 | v77.45,67.94 LED_R2C3.2
  Bottom 0.305: CN3.30 46.18,8.08 47.14,8.08 48.25,9.2 49.21,9.2 50.33,10.31 51.29,10.31 52.41,11.43 53.37,11.43 54.51,12.57 75.16,12.57 77.36,14.78 77.36,17.41 77.76,17.8 77.76,32.72 v77.45,33.02 77.45,35.92 77.76,36.22 77.76,67.64 v77.45,67.94 77.45,70.95 77.76,71.25 77.76,101.47 76.36,102.87 LED_R1C3.2
COL3_N  (via drill 0.5)
  Top 0.305: v81.97,33.02 LED_R3C3.17 | v81.97,67.94 LED_R2C3.17
  Bottom 0.305: CN3.35 53.34,5.08 53.34,6.73 54.13,7.52 54.99,7.52 56.13,8.66 76.78,8.66 81.27,13.15 81.27,15.79 81.67,16.18 81.67,26.06 82.87,27.26 82.87,28.53 82.27,29.13 82.27,31.54 81.67,32.15 81.67,32.72 v81.97,33.02 81.97,34.6 82.57,35.2 82.57,35.92 81.97,36.51 81.97,37.07 81.67,37.37 81.67,60.98 82.87,62.19 82.87,63.45 82.27,64.05 82.27,66.45 81.67,67.06 81.67,67.64 v81.97,67.94 81.97,69.53 82.57,70.13 82.57,70.84 82.07,71.34 82.06,71.34 81.97,71.44 81.97,72 81.67,72.3 81.67,95.91 82.87,97.11 82.87,98.38 81.52,99.73 81.52,101.52 82.87,102.87 LED_R1C3.17
COL3_P  (via drill 0.5)
  Top 0.305: v81.45,27.94 LED_R3C3.15 | v81.45,62.87 LED_R2C3.15 | v81.45,97.79 LED_R1C3.15
  Bottom 0.305: CN3.33 50.8,5.08 50.8,6.73 51.59,7.52 52.45,7.52 53.57,8.64 54.52,8.64 55.67,9.78 76.31,9.78 80.15,13.62 80.15,16.25 80.55,16.65 80.55,26.52 81.15,27.12 81.15,27.64 v81.45,27.94 81.15,28.24 81.15,31.08 80.55,31.68 80.55,34.21 80.85,34.51 80.85,36.61 80.55,36.91 80.55,61.44 81.15,62.05 81.15,62.56 v81.45,62.87 81.45,63.17 81.15,63.47 81.15,65.99 80.55,66.59 80.55,69.13 80.85,69.44 80.85,71.53 80.55,71.84 80.55,96.37 81.15,96.97 81.15,97.49 v81.45,97.79
COL3_R  (via drill 0.5)
  Top 0.305: v83.64,25.24 83.81,25.4 LED_R3C3.14 | v83.64,60.16 83.81,60.33 LED_R2C3.14
  Bottom 0.305: CN3.40 57.78,6.99 77.47,6.99 83.58,13.09 83.58,15.64 83.34,15.88 83.34,24.94 v83.64,25.24 84.55,26.14 84.55,29.22 83.94,29.82 83.94,34.21 84.25,34.51 84.25,36.61 83.64,37.21 83.64,37.77 83.34,38.07 83.34,48.12 83.94,48.73 83.94,50.75 83.34,51.35 83.34,59.86 v83.64,60.16 84.55,61.06 84.55,64.15 83.94,64.75 83.94,69.13 84.25,69.44 84.25,71.53 83.64,72.14 83.64,72.69 83.34,72.99 83.34,83.05 83.94,83.65 83.94,84.89 82.23,86.61 82.23,93.68 83.8,95.25 LED_R1C3.14
COL3_S
  Bottom 0.305: CN3.26 41.1,8.08 42.06,8.08 43.17,9.2 44.13,9.2 45.25,10.31 46.21,10.31 47.33,11.43 48.29,11.43 50.32,13.47 50.32,15.72 51.12,16.51 52.86,16.51 54.57,14.81 64.18,14.81 65.88,16.51 73.85,16.51 74.52,17.18 74.52,18.37 74.82,18.67 74.82,21.04 75.52,21.74 75.52,22.56 75.22,22.86 | 75.22,22.86 75.22,24.74 74.92,25.04 74.92,25.76 75.52,26.36 75.52,31.37 74.92,31.97 74.92,36.54 75.52,37.14 75.52,51.52 74.92,52.12 74.92,56.06 75.52,56.67 75.52,57.48 75.22,57.78 | 75.22,57.78 75.22,59.67 74.92,59.97 74.92,60.68 75.52,61.28 75.52,66.29 74.92,66.89 74.92,71.57 75.52,72.17 75.52,86.44 74.92,87.04 74.92,91.73 73.94,92.71 LED_R1C3.6 | LED_R2C3.6 75.22,57.78 | LED_R3C3.6 75.22,22.86
COL3_T  (via drill 0.5)
  Top 0.305: v76.9,20.32 LED_R3C3.7 | v76.9,55.24 LED_R2C3.7 | v76.9,90.17 LED_R1C3.7
  Bottom 0.305: CN3.27 43.18,5.08 43.18,6.73 43.97,7.52 44.83,7.52 45.95,8.64 46.91,8.64 48.02,9.75 48.98,9.75 50.1,10.87 51.06,10.87 52.18,11.99 53.14,11.99 54.28,13.13 74.92,13.13 76.8,15.01 76.8,17.64 77.2,18.04 77.2,20.02 v76.9,20.32 77.2,20.62 77.2,32.06 76.59,32.66 76.59,35.85 77.2,36.45 77.2,54.94 v76.9,55.24 77.2,55.55 77.2,66.99 76.59,67.59 76.59,70.88 77.2,71.48 77.2,89.87 v76.9,90.17
COL3_U  (via drill 0.5)
  Top 0.305: v75.78,25.4 LED_R3C3.5 | v75.78,60.33 LED_R2C3.5
  Bottom 0.305: CN3.25 40.64,5.08 40.64,6.73 41.43,7.52 42.29,7.52 43.41,8.64 44.37,8.64 45.48,9.75 46.44,9.75 47.56,10.87 48.52,10.87 49.64,11.99 50.6,11.99 51.71,13.11 52.67,13.11 53.82,14.25 74.46,14.25 75.68,15.47 75.68,16.82 75.08,17.42 75.08,18.14 75.38,18.44 75.38,20.81 76.08,21.51 76.08,25.1 v75.78,25.4 76.08,25.7 76.08,31.6 75.48,32.2 75.48,36.31 76.08,36.91 76.08,51.75 75.48,52.35 75.48,55.83 76.08,56.43 76.08,60.02 v75.78,60.33 76.08,60.63 76.08,66.52 75.48,67.13 75.48,71.34 76.08,71.94 76.08,86.67 75.48,87.27 75.48,93.81 74.04,95.25 LED_R1C3.5
COL4\_C  (via drill 0.5)
  Top 0.305: v102.25,100.33 LED_R1C4.16 | v102.25,65.41 LED_R2C4.16 | v101.19,30.48 LED_R3C4.16
  Bottom 0.305: CN2.11 133.27,112.91 133.27,112.64 132.39,111.76 131.16,111.76 130.12,110.72 129.16,110.72 128.13,109.69 127.17,109.69 126.05,108.57 125.09,108.57 123.96,107.44 104.23,107.44 103.27,106.48 103.27,104.85 102.85,104.43 102.85,102.12 101.95,101.22 101.95,100.63 v102.25,100.33 101.95,100.03 101.95,98.75 102.55,98.15 102.55,97.43 101.95,96.83 101.95,72.07 102.95,71.06 102.95,69.78 102.55,69.38 102.55,66.89 101.95,66.29 101.95,65.71 v102.25,65.41 102.25,63.52 102.55,63.22 102.55,62.51 101.95,61.91 101.95,37.14 102.95,36.14 102.95,33.74 100.89,31.68 100.89,30.78 v101.19,30.48
COL4_A  (via drill 0.5)
  Top 0.305: v99.46,105.41 LED_R1C4.1 | v99.16,70.48 LED_R2C4.1 | v99.16,35.56 LED_R3C4.1
  Bottom 0.305: CN2.8 127.64,114.89 127.64,113.19 126.93,112.48 126.01,112.48 124.89,111.36 123.94,111.36 122.81,110.24 103.08,110.24 99.16,106.32 99.16,105.61 99.35,105.41 v99.46,105.41 99.16,105.11 99.16,70.71 v99.16,70.48 99.16,35.66 v99.16,35.56
COL4_B  (via drill 0.5)
  Top 0.305: v101.73,105.41 LED_R1C4.18 | v101.43,70.48 LED_R2C4.18 | v101.43,35.56 LED_R3C4.18
  Bottom 0.305: CN2.9 129.66,111.84 128.7,111.84 127.67,110.81 126.71,110.81 125.59,109.69 124.63,109.69 123.5,108.56 103.77,108.56 101.43,106.22 101.43,105.71 v101.73,105.41 101.73,102.58 100.83,101.68 100.83,79.06 100.83,71.61 101.43,71 v101.43,70.48 101.43,67.36 100.83,66.76 100.83,36.68 101.13,36.38 101.13,35.86 v101.43,35.56
COL4_D  (via drill 0.5)
  Top 0.305: v102.81,92.71 LED_R1C4.13 | v102.81,57.78 LED_R2C4.13 | v100.97,22.86 LED_R3C4.13
  Bottom 0.305: CN2.14 135.25,114.89 135.25,113.03 134.71,112.48 133.83,112.48 133.83,112.41 132.62,111.2 131.39,111.2 130.35,110.16 129.39,110.16 128.36,109.13 127.4,109.13 126.28,108.01 125.32,108.01 124.2,106.88 104.46,106.88 103.83,106.25 103.83,104.62 103.41,104.2 103.41,101.89 103.11,101.59 103.11,97.2 102.51,96.6 102.51,93.01 v102.81,92.71 102.51,92.41 102.51,72.3 103.51,71.3 103.51,69.55 103.11,69.14 103.11,62.28 102.51,61.68 102.51,58.09 v102.81,57.78 102.51,57.48 102.51,37.37 103.51,36.37 103.51,29.22 100.97,26.67 v100.97,22.86
COL4_E  (via drill 0.5)
  Top 0.305: v104.48,84.01 105.57,85.09 LED_R1C4.10 | LED_R2C4.10 105.57,50.16 v104.48,49.08
  Bottom 0.305: CN2.15 138.35,112.91 138.35,112.8 137.47,111.92 136.51,111.92 135.4,110.81 134.6,110.81 133.32,109.53 132.09,109.53 130.33,107.77 130.33,105.25 129.22,104.14 124.94,104.14 123.87,105.21 115.92,105.21 114.62,103.91 114.62,102.55 113.67,101.6 105.49,101.6 104.79,100.89 104.79,91.89 104.18,91.29 104.18,86.05 104.79,85.45 104.79,84.31 v104.48,84.01 104.18,83.71 104.18,72.99 105.19,71.99 105.19,68.85 104.79,68.45 104.79,56.97 104.18,56.36 104.18,51.12 104.79,50.52 104.79,49.38 v104.48,49.08 104.18,48.78 104.18,38.07 105.19,37.06 105.19,28.52 103.27,26.6 103.27,17.06 105.09,15.24 LED_R3C4.10
COL4_F  (via drill 0.5)
  Top 0.305: v103.93,85.09 LED_R1C4.9 | v103.93,50.16 LED_R2C4.9
  Bottom 0.305: CN2.16 137.79,114.89 137.79,113.03 137.25,112.48 136.29,112.48 135.17,111.36 134.37,111.36 133.09,110.08 131.85,110.08 130.81,109.04 129.85,109.04 128.82,108.01 127.86,108.01 126.75,106.89 125.79,106.89 124.66,105.77 115.69,105.77 113.81,103.89 105.23,103.89 104.53,103.19 104.53,101.43 104.23,101.12 104.23,92.12 103.63,91.52 103.63,85.39 v103.93,85.09 103.63,84.79 103.63,72.76 104.63,71.76 104.63,69.08 104.23,68.68 104.23,57.2 103.63,56.6 103.63,50.47 v103.93,50.16 103.63,49.86 103.63,37.84 104.63,36.83 104.63,28.75 102.71,26.84 102.71,16.99 100.97,15.24 LED_R3C4.9
COL4_G  (via drill 0.5)
  Top 0.305: v96.06,87.63 LED_R1C4.8 | v96.06,52.7 LED_R2C4.8
  Bottom 0.305: CN2.1 120.69,113.03 101.92,113.03 96.36,107.47 96.36,101.75 95.76,101.15 95.76,92.12 96.36,91.52 96.36,87.93 v96.06,87.63 96.36,87.33 96.36,72.07 96.06,71.77 96.06,69.2 96.36,68.9 96.36,66.83 95.76,66.22 95.76,57.2 96.36,56.6 96.36,53.01 v96.06,52.7 96.36,52.4 96.36,37.14 96.06,36.84 96.06,33.97 96.83,33.2 96.83,31.9 96.22,31.3 96.22,25.06 97.47,23.81 97.47,19.37 95.89,17.78 LED_R3C4.8
COL4_H  (via drill 0.5)
  Top 0.305: v98.3,97.79 LED_R1C4.4 | v98.3,62.87 LED_R2C4.4 | v99.06,27.94 LED_R3C4.4
  Bottom 0.305: CN2.5 124.66,111.92 123.7,111.92 122.58,110.8 102.84,110.8 98.6,106.55 98.6,98.09 v98.3,97.79 98.6,97.49 98.6,71.14 98.3,70.84 98.3,70.13 98.6,69.83 98.6,63.17 v98.3,62.87 98.6,62.56 98.6,36.22 98.3,35.92 98.3,34.9 99.06,34.13 v99.06,27.94
COL4_K  (via drill 0.5)
  Top 0.305: v97.74,100.33 LED_R1C4.3 | v97.74,65.41 LED_R2C4.3 | v98.2,30.48 LED_R3C4.3
  Bottom 0.305: CN2.6 125.09,114.89 125.09,113.19 124.39,112.48 123.47,112.48 122.34,111.35 102.61,111.35 98.04,106.78 98.04,100.63 v97.74,100.33 97.74,98.45 97.44,98.15 97.44,97.43 98.04,96.83 98.04,71.37 97.74,71.07 97.74,69.9 98.04,69.6 98.04,65.71 v97.74,65.41 97.74,63.52 97.44,63.22 97.44,62.51 98.04,61.91 98.04,36.45 97.74,36.15 97.74,34.66 98.5,33.9 98.5,30.78 v98.2,30.48
COL4_M  (via drill 0.5)
  Top 0.305: v100.02,102.87 LED_R1C4.2 | v100.02,67.94 LED_R2C4.2 | v99.92,33.02 LED_R3C4.2
  Bottom 0.305: CN2.7 127.2,111.92 126.24,111.92 125.13,110.81 124.17,110.81 123.04,109.68 103.31,109.68 100.32,106.69 100.32,105.05 99.81,104.55 99.71,104.46 99.71,103.17 v100.02,102.87 99.71,102.57 99.71,71.14 100.02,70.84 100.02,70.13 99.71,69.83 99.71,68.25 v100.02,67.94 99.71,67.64 99.71,36.22 100.02,35.92 100.02,34.93 99.62,34.53 99.62,33.32 v99.92,33.02
COL4_N  (via drill 0.5)
  Top 0.305: v100.57,103.95 101.66,102.87 LED_R1C4.17 | v100.57,69.03 101.66,67.94 LED_R2C4.17 | v100.71,33.87 101.56,33.02 LED_R3C4.17
  Bottom 0.305: CN2.10 130.18,114.89 130.18,113.19 129.38,112.39 128.47,112.39 127.43,111.36 126.47,111.36 125.36,110.25 124.4,110.25 123.27,109.12 103.54,109.12 100.87,106.45 100.87,104.25 v100.57,103.95 100.57,103.53 100.87,103.23 100.87,102.51 100.27,101.91 100.27,71.37 100.57,71.07 100.57,69.9 100.35,69.67 100.35,69.25 v100.57,69.03 100.57,68.6 100.87,68.3 100.87,67.59 100.27,66.99 100.27,36.45 100.57,36.15 100.57,34.01 v100.71,33.87
COL4_P  (via drill 0.5)
  Top 0.305: v101.69,97.79 LED_R1C4.15 | v101.69,62.87 LED_R2C4.15 | v100.33,27.94 LED_R3C4.15
  Bottom 0.305: CN2.12 132.72,114.89 132.72,112.87 132.24,112.39 131,112.39 129.89,111.28 128.93,111.28 127.9,110.25 126.94,110.25 125.82,109.13 124.86,109.13 123.73,108 104,108 102.71,106.71 102.71,105.08 102.29,104.66 102.29,102.35 101.39,101.45 101.39,98.09 v101.69,97.79 101.39,97.49 101.39,71.84 102.39,70.83 102.39,70.01 101.99,69.61 101.99,67.13 101.39,66.52 101.39,63.17 v101.69,62.87 101.39,62.56 101.39,36.91 102.39,35.91 102.39,33.97 100.33,31.91 v100.33,27.94
COL4_R  (via drill 0.5)
  Top 0.305: v103.37,95.25 LED_R1C4.14 | v103.37,60.33 LED_R2C4.14 | v101.83,25.4 LED_R3C4.14
  Bottom 0.305: CN2.13 135.81,112.91 135.81,112.8 134.94,111.92 134.14,111.92 132.86,110.64 131.62,110.64 130.58,109.6 129.62,109.6 128.59,108.57 127.63,108.57 126.52,107.45 125.56,107.45 124.43,106.32 115.46,106.32 113.58,104.45 105.26,104.45 105.25,104.46 104.46,104.46 103.97,103.97 103.97,101.66 103.67,101.36 103.67,96.97 103.07,96.37 103.07,95.55 v103.37,95.25 103.37,93.37 103.67,93.07 103.67,92.35 103.17,91.85 103.16,91.85 103.07,91.76 103.07,72.53 104.07,71.53 104.07,69.31 103.67,68.91 103.67,62.05 103.07,61.44 103.07,60.63 v103.37,60.33 103.37,58.44 103.67,58.14 103.67,57.43 103.07,56.83 103.07,37.61 104.07,36.6 104.07,28.98 101.52,26.44 101.52,25.7 v101.83,25.4
COL4_S  (via drill 0.5)
  Top 0.305: v97.18,92.71 LED_R1C4.6 | v97.18,57.78 LED_R2C4.6 | v98.74,22.86 LED_R3C4.6
  Bottom 0.305: CN2.3 122.11,111.91 102.38,111.91 97.48,107.01 97.48,101.29 96.88,100.69 96.88,99.97 97.18,99.67 97.18,98.68 96.88,98.38 96.88,97.2 97.48,96.6 97.48,93.01 v97.18,92.71 97.48,92.41 97.48,92.08 97.48,71.61 97.18,71.3 97.18,69.67 97.48,69.36 97.48,66.36 96.88,65.76 96.88,62.28 97.48,61.68 97.48,58.09 v97.18,57.78 97.48,57.48 97.48,36.68 97.18,36.38 97.18,34.43 97.94,33.67 97.94,31.44 97.34,30.84 97.34,28.44 98.74,27.04 v98.74,22.86
COL4_T
  Bottom 0.305: CN2.2 118.71,113.59 101.69,113.59 95.8,107.7 95.8,101.98 95.2,101.38 95.2,91.89 95.8,91.29 95.8,90.47 95.5,90.17 | 95.5,90.17 95.5,88.29 95.2,87.99 95.2,87.27 95.8,86.67 95.8,72.3 95.5,72 95.5,68.97 95.8,68.67 95.8,67.06 95.2,66.45 95.2,56.97 95.8,56.36 95.8,55.55 95.5,55.24 | 95.5,55.24 95.5,53.36 95.2,53.06 95.2,52.35 95.8,51.75 95.8,37.37 95.5,37.07 95.5,33.74 96.27,32.97 96.27,32.13 95.66,31.53 95.66,24.83 96.91,23.58 96.91,21.89 95.34,20.32 LED_R3C4.7 | LED_R1C4.7 95.5,90.17 | LED_R2C4.7 95.5,55.24
COL4_U  (via drill 0.5)
  Top 0.305: v96.62,95.25 LED_R1C4.5 | v96.62,60.33 LED_R2C4.5 | v97.88,25.4 LED_R3C4.5
  Bottom 0.305: CN2.4 122.56,114.89 122.56,113.24 121.78,112.47 102.15,112.47 96.92,107.24 96.92,101.52 96.32,100.92 96.32,96.97 96.92,96.37 96.92,95.55 v96.62,95.25 96.62,93.37 96.32,93.07 96.32,92.35 96.92,91.75 96.92,71.84 96.62,71.53 96.62,69.44 96.92,69.13 96.92,66.59 96.32,65.99 96.32,62.05 96.92,61.44 96.92,60.63 v96.62,60.33 96.62,58.44 96.32,58.14 96.32,57.43 96.92,56.83 96.92,36.91 96.62,36.61 96.62,34.2 97.38,33.44 97.38,31.67 96.78,31.07 96.78,28.21 98.18,26.81 98.18,25.7 v97.88,25.4
COL5\_S  (via drill 0.5)
  Top 0.305: v115.9,22.86 LED_R3C5.6 | v115.9,57.78 LED_R2C5.6 | v117.02,92.71 LED_R1C5.6